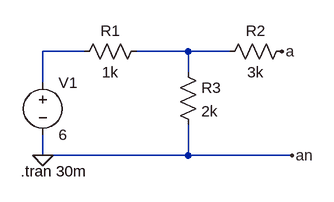
[diagram p0: schematic Draft34.asc]
Draft34.asc, the LTspice schematic file:
Version 4
SHEET 1 880 680
WIRE 128 64 64 64
WIRE 288 64 208 64
WIRE 352 64 288 64
WIRE 288 96 288 64
WIRE 64 112 64 64
WIRE 64 224 64 192
WIRE 288 224 288 176
WIRE 288 224 64 224
WIRE 448 224 288 224
FLAG 64 224 0
FLAG 448 224 an
FLAG 432 64 a
SYMBOL voltage 64 96 R0
WINDOW 123 0 0 Left 0
WINDOW 39 0 0 Left 0
SYMATTR InstName V1
SYMATTR Value 6
SYMBOL res 224 48 R90
WINDOW 0 0 56 VBottom 2
WINDOW 3 32 56 VTop 2
SYMATTR InstName R1
SYMATTR Value 1k
SYMBOL res 448 48 R90
WINDOW 0 0 56 VBottom 2
WINDOW 3 32 56 VTop 2
SYMATTR InstName R2
SYMATTR Value 3k
SYMBOL res 272 80 R0
SYMATTR InstName R3
SYMATTR Value 2k
TEXT 30 248 Left 2 !.tran 30m

The netlist it stands for:
* Draft34.asc
V1 N001 0 6
R1 N002 N001 1k
R2 a N002 3k
R3 N002 0 2k
.tran 30m
.backanno
.end